# EAGLE design piezo-jfet-buffer-simple-set-resistor (EAGLE 7.5.0)
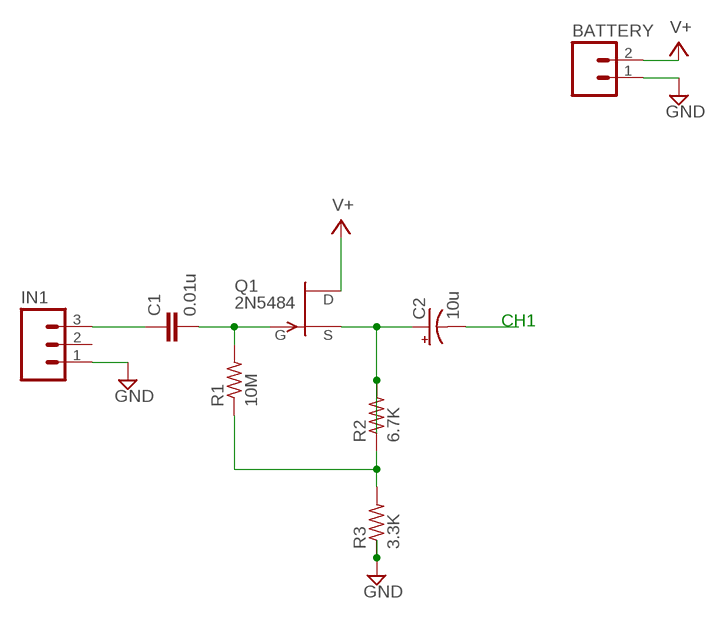
[diagram p0: schematic, sheet 1]

## Parts
BATTERY  M02PTH  [1X02]
C1  0.01u  C5/3  [C5B3]
C2  10u  CAP_POLPTH2  [CPOL-RADIAL-10UF-25V]
IN1  M03LOCK  [1X03_LOCK]
Q1  2N5484  [TO92-]
R1  10M  R-US_0414/5V  [0414V]
R2  6.7K  R-US_0414/5V  [0414V]
R3  3.3K  R-US_0414/5V  [0414V]

## Nets
CH1: C2.2(-)
GND: BATTERY.1 IN1.1 R3.1
JFET-GATE: C1.2 Q1.1(G) R1.2
JFET-SOURCE: C2.1(+) Q1.2(S) R2.2
N$1: C1.1 IN1.3
N$3: R1.1 R2.1 R3.2
V+: BATTERY.2 Q1.3(D)
Unconnected: IN1.2

## Notes on the sheet
- CH1

## Library data of the parts
BATTERY = SparkFun-Connectors:M02: Header 2 Standard 2-pin 0.1" header. Use with straight break away headers (SKU : PRT-00116), right angle break away headers (PRT-00553), swiss pins (PRT-00743), machine pins (PRT-00117), and female headers (PRT-00115). Molex polarized connector foot print use with SKU : PRT-08233 with associated crimp pins and housings.
C1 = capacitor-wima:C: CAPACITOR naming: grid - package width
C2 = SparkFun-Passives:CAP_POL: Capacitor Polarized These are standard SMD and PTH capacitors. Normally 10uF, 47uF, and 100uF in electrolytic and tantalum varieties. Always verify the external diameter of the through hole cap, it varies with capacity, voltage, and manufacturer. The EIA devices should be standard.
IN1 = SparkFun-Connectors:M03: Header 3 Standard 3-pin 0.1" header. Use with straight break away headers (SKU : PRT-00116), right angle break away headers (PRT-00553), swiss pins (PRT-00743), machine pins (PRT-00117), and female headers (PRT-00115). Molex polarized connector foot print use with SKU : PRT-08232 with associated crimp pins and housings.
Q1 = transistor-fet:?548*: N-Channel JFETs Source: VISHAY 2N5484.pdf Compatible: TO92 2N5245 J304 J305 U310 J308 J309 J310 TO72 2N4416 2N4416A 2N3823 2N4351 3N169 3N170 3N171 MFE3002 TO18 2N3796 2N3797 MFE825 Source: Motorola European Master Guide Pacge 3-59
R1-R3 = resistor:R-US_: RESISTOR, American symbol

## Board
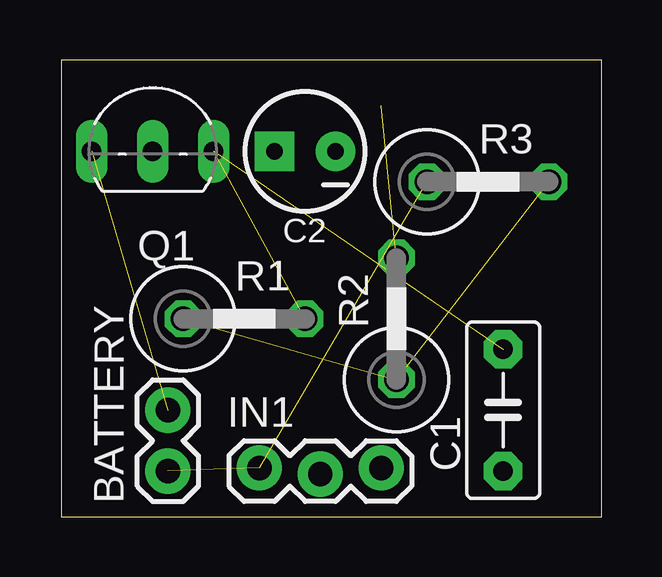
[diagram p1: board, top side]
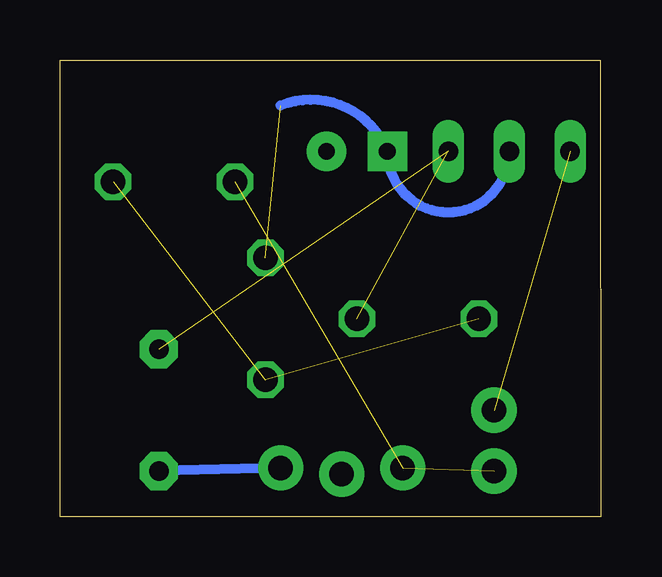
[diagram p2: board, bottom side, seen from below]

Size 22.53 x 19.05 mm. Coordinates in mm from the lower left corner, seen from the top.
Outline: 0,0 22.53,0 22.53,19.04 0.01,19.05 0,0
Copper layers (1*16): Top 0.035mm / dielectric 1.5mm / Bottom 0.035mm
Design rules "default": minimum track width 10mil, minimum drill 24mil, track to track 8mil, track to pad 8mil, pad to pad 8mil, via to via 8mil, smd to smd 8mil, copper to edge 40mil, drill to drill 8mil, minimum pad ring 10mil, minimum via ring 8mil, stop-mask expansion 4mil, vias tented up to drill 0mil, thermal gap 10mil

### Footprints (pad centres in the part's own frame; a part is rotated, then mirrored left to right if it is on the bottom)
1X02 = drill 1.016 pad 1.88: 1 0,0; 2 2.54,0
C5B3 = drill 0.813 pad 1.6 octagon: 1 -2.54,0; 2 2.54,0
CPOL-RADIAL-10UF-25V = drill 0.7 pad 1.651 square: 1 1.27,0 | drill 0.7 pad 1.651: 2 -1.27,0
1X03_LOCK = drill 1.016 pad 1.88: 1 0,0.127; 2 2.54,-0.127; 3 5.08,0.127
TO92- = drill 0.813 long: 1 2.54,0; 2 0,0; 3 -2.54,0
0414V = drill 1.016 octagon: 1 -2.54,0; 2 2.54,0

### Placement (x,y rotation side)
BATTERY  4.45,1.91 90 top
C1  18.41,4.45 90 top
C2  10.16,15.24 180 top
IN1  8.26,1.91 0 top
Q1  3.81,15.24 0 top
R1  7.62,8.26 0 top
R2  13.97,8.26 90 top
R3  17.78,13.97 0 top

### Tracks (layer width: path | path; a pad name or v marks a point on that pad's centre or on a via)
GND  (2 unrouted)
JFET-GATE  (2 unrouted)
JFET-SOURCE  (1 unrouted)
  Bottom 0.406: Q1.2 arc90 6.35,12.7 arc90 C2.1 arc-90 13.34,17.14
N$1
  Bottom 0.406: IN1.3 C1.1
N$3  (2 unrouted)
V+  (1 unrouted)